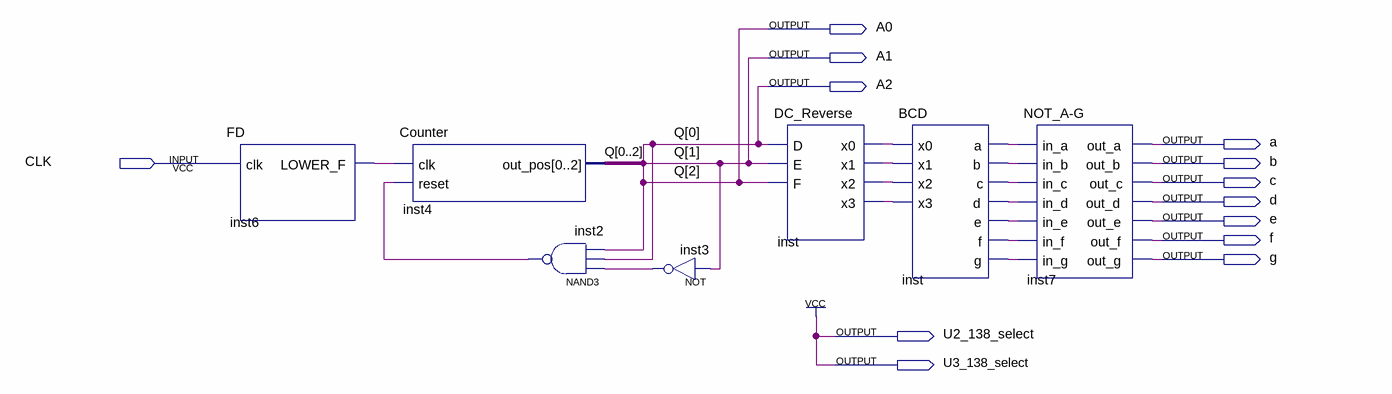
[diagram p0: schematic sheet]
// Quartus schematic main.bdf as structural Verilog: 7 symbols, 13 pins
module main (
  input  CLK,
  output A0,
  output A1,
  output A2,
  output a,
  output b,
  output c,
  output d,
  output e,
  output f,
  output g,
  output U2_138_select,
  output U3_138_select
);

  wire inst2_out, inst3_out, inst6_lower_f, inst_a, inst_b, inst_c, inst_d, inst_e, inst_f, inst_g, inst_x0,
       inst_x1, inst_x2, inst_x3;

  FD inst6 (.clk(CLK), .LOWER_F(inst6_lower_f));
  Counter inst4 (.clk(inst6_lower_f), .reset(inst2_out), .out_pos({A2, A1, A0}));
  nand inst2 (inst2_out, inst3_out, A2, A0);
  not inst3 (inst3_out, A1);
  DC_Reverse inst (.D(A2), .E(A1), .F(A0), .x0(inst_x0), .x1(inst_x1), .x2(inst_x2), .x3(inst_x3));
  BCD inst_dup2 (
    .x0(inst_x0), .x1(inst_x1), .x2(inst_x2), .x3(inst_x3), .a(inst_a), .b(inst_b), .c(inst_c), .d(inst_d),
    .e(inst_e), .f(inst_f), .g(inst_g));
  \NOT_A-G  inst7 (
    .in_a(inst_a), .in_b(inst_b), .in_c(inst_c), .in_d(inst_d), .in_e(inst_e), .in_f(inst_f), .in_g(inst_g),
    .out_a(a), .out_b(b), .out_c(c), .out_d(d), .out_e(e), .out_f(f), .out_g(g));

  assign U2_138_select = 1'b1;
  assign U3_138_select = 1'b1;

  // Other names for the same wires on the sheet: Q[2:0] = {A0, A1, A2}
endmodule
